# Altium schematic sheet A_USB2Serial.SchDoc
size A4; DocumentNumber: 3; SheetNumber: 3; SheetTotal: 5
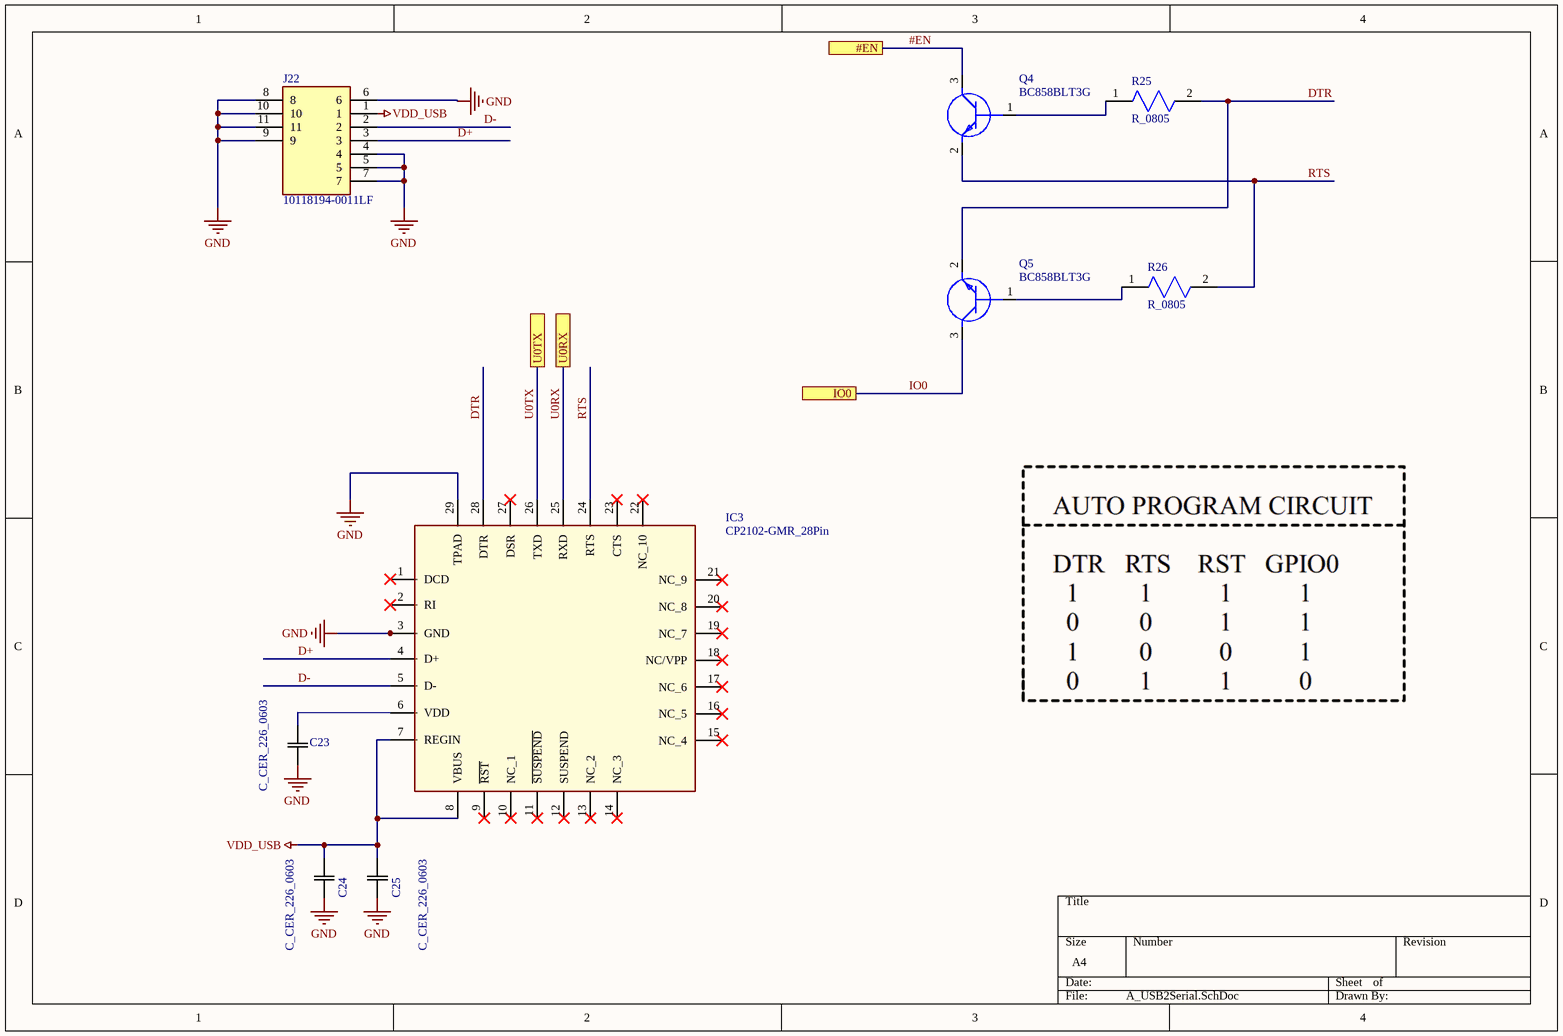
[diagram p0: A_USB2Serial.SchDoc]

## Parts
C23  C_CER_226_0603  [CAPC1608X90N]
C24  C_CER_226_0603  [CAPC1608X90N]
C25  C_CER_226_0603  [CAPC1608X90N]
IC3  CP2102-GMR_28Pin  [QFN50P500X500X100-29N-D]
J22  10118194-0011LF  [101181940011LF]
Q4  BC858BLT3G  [SOT96P237X111-3N]
Q5  BC858BLT3G  [SOT96P237X111-3N]
R25  R_0805  [RESC2012X55N]
R26  R_0805  [RESC2012X55N]

## Ports
#EN, IO0, U0RX, U0TX

## Nets
GND: C23.1 C24.1 C25.1 IC3.3(GND) IC3.29(TPAD) J22.4 J22.5 J22.6 J22.7 J22.8 J22.9 J22.10 J22.11
VDD_USB: C24.2 C25.2 IC3.7(REGIN) IC3.8(VBUS) J22.1
#EN: Q4.3(C) ; port #EN
D+: IC3.4(D+) J22.3
D-: IC3.5(D-) J22.2
DTR: IC3.28(DTR) Q5.2(E) R25.2
IO0: Q5.3(C) ; port IO0
RTS: IC3.24(RTS) Q4.2(E) R26.2
U0RX: IC3.25(RXD) ; port U0RX
U0TX: IC3.26(TXD) ; port U0TX
NetC23_2: C23.2 IC3.6(VDD)
NetQ4_1: Q4.1(B) R25.1
NetQ5_1: Q5.1(B) R26.1

Not connected (* = marked no-connect by the designer): IC3 1(DCD)* 2(RI)* 9(~{RST})* 10(NC_1)* 11(~{SUSPEND})* 12(SUSPEND)* 13(NC_2)* 14(NC_3)* 15(NC_4)* 16(NC_5)* 17(NC_6)* 18(NC/VPP)* 19(NC_7)* 20(NC_8)* 21(NC_9)* 22(NC_10)* 23(CTS)* 27(DSR)*

## Library data of the parts
C23-C25 = C_CER_226_0603: Manufacturer_Part_Number: GRM188R60J226MEA0D; Vendor: Murata; SourceLibrary: Murata_2014-12-31; Type: DEV; Copyright: Copyright (C) 2015 Accelerated Designs. All rights reserved; RefDes: RefDes
IC3 = CP2102-GMR_28Pin: Integrated Circuit; Manufacturer_Name: Silicon Labs; Datasheet Link: https://www.silabs.com/Support%20Documents/TechnicalDocs/CP2102-9.pdf; Height: 1mm; Manufacturer_Part_Number: CP2102-GMR
J22 = 10118194-0011LF: Connector; Manufacturer_Name: Amphenol; Datasheet Link: https://cdn.amphenol-icc.com/media/wysiwyg/files/drawing/10118194.pdf; Height: 2mm; Manufacturer_Part_Number: 10118194-0011LF
Q4 Q5 = BC858BLT3G: Transistor BJT PNP; Manufacturer_Name: ON Semiconductor; Datasheet Link: https://www.onsemi.com/pub/Collateral/BC856ALT1-D.PDF; Height: 1.11mm; Manufacturer_Part_Number: BC858BLT3G
R25 R26 = R_0805: Resistor; Manufacturer_Name: Vishay; Datasheet Link: http://www.vishay.com/docs/20035/dcrcwe3.pdf; Height: 0.4mm